# Altium schematic sheet Res 309K 805.schdoc
size 127 x 99 mm
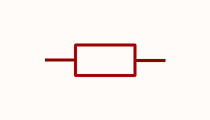
[diagram p0: Res 309K 805.schdoc]

## Parts
R?  309kΩ  [R0805]  (value not drawn)

## Nets

Not connected (* = marked no-connect by the designer): R? 1 2

## Library data of the parts
R? = ERJ6ENF3093V: Manufacturer: PANASONIC(松下); Add into BOM: yes; Tolerance: ±1%; Temperature Coefficient: ±100ppm/℃; Symbol: ERJ6ENF3093V; Device: ERJ6ENF3093V; LCSC Part Name: 309kΩ ±1% 125mW 厚膜电阻; Supplier Part: C410005; Manufacturer Part: ERJ6ENF3093V; Supplier Footprint: 0805; JLCPCB Part Class: Extended Part; Datasheet: https://atta.szlcsc.com/upload/public/pdf/source/20190806/C410005_411FBB62F8BDC8BC9CE172F2BD7302D6.pdf; Supplier: LCSC; Convert to PCB: yes; Type: Thick Film Resistors; Value: 309kΩ; Overload Voltage (Max): -; Operating Temperature Range: -55℃~+155℃